# Altium schematic sheet mpll32.SchDoc
size A4
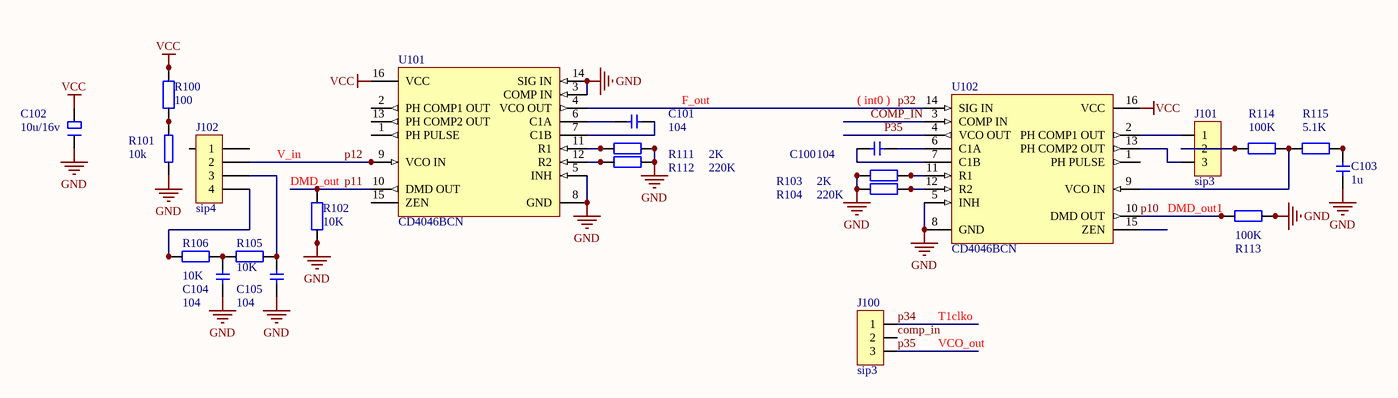
[diagram p0: mpll32.SchDoc]

## Parts
C100  104  [cap010805]
C101  104  [cap010805]
C102  10u/16v  [rb.1/.2]
C103  value 1u  [cap010805]  (hidden comment: 104)
C104  104  [cap010805]
C105  104  [cap010805]
J100  value sip3  [SIP3]  (hidden comment: CON3)
J101  value sip3  [SIP3]  (hidden comment: CON3)
J102  value sip4  [SIP4]  (hidden comment: CON4)
R100  value 100  [a030805]  (hidden comment: Res22)
R101  10k  [VR-5]
R102  value 10K  [a030805]  (hidden comment: Res22)
R103  value 2K  [a030805]  (hidden comment: Res22)
R104  value 220K  [a030805]  (hidden comment: Res22)
R105  value 10K  [a030805]  (hidden comment: RES22)
R106  value 10K  [a030805]  (hidden comment: RES22)
R111  value 2K  [a030805]  (hidden comment: Res22)
R112  value 220K  [a030805]  (hidden comment: Res22)
R113  value 100K  [a030805]  (hidden comment: Res22)
R114  value 100K  [a030805]  (hidden comment: Res22)
R115  value 5.1K  [a030805]  (hidden comment: Res22)
U101  CD4046BCN  [dip16]
U102  CD4046BCN  [dip16]

## Nets
GND: C102.1 C103.1 C104.2 C105.2 R101.1 R102.1 R102.3 R103.1 R103.3 R104.1 R104.3 R111.1 R111.3 R112.1 R112.3 R113.2 R113.4 U101.3(COMP_IN) U101.5(INH) U101.8(GND) U101.14(SIG_IN) U102.5(INH) U102.8(GND)
VCC: C102.2 R100.2 R100.4 U101.16(VCC) U102.16(VCC)
comp_in: J100.2 U102.3(COMP_IN)
p10: R113.1 R113.3 U102.10(DMD_OUT)
p11: R102.2 R102.4 U101.10(DMD_OUT)
p12: J102.2 U101.9(VCO_IN)
p32: U101.4(VCO_OUT) U102.14(SIG_IN)
p34: J100.1
p35: J100.3 U102.4(VCO_OUT)
NetC100_1: C100.1 U102.7(C1B)
NetC100_2: C100.2 U102.6(C1A)
NetC101_1: C101.1 U101.7(C1B)
NetC101_2: C101.2 U101.6(C1A)
NetC103_2: C103.2 R115.1 R115.3
NetC104_1: C104.1 R105.1 R105.3 R106.2 R106.4
NetC105_1: C105.1 J102.3 R105.2 R105.4
NetJ101_1: J101.1 U102.2(PH_COMP1_OUT)
NetJ101_2: J101.2 R114.1 R114.3
NetJ101_3: J101.3 U102.13(PH_COMP2_OUT)
NetJ102_1: J102.1 R101.2
NetJ102_4: J102.4 R106.1 R106.3
NetR100_1: R100.1 R100.3 R101.3
NetR103_2: R103.2 R103.4 U102.11(R1)
NetR104_2: R104.2 R104.4 U102.12(R2)
NetR111_2: R111.2 R111.4 U101.11(R1)
NetR112_2: R112.2 R112.4 U101.12(R2)
NetR114_2: R114.2 R114.4 R115.2 R115.4 U102.9(VCO_IN)

Not connected (* = marked no-connect by the designer): U101 1(PH_PULSE) 2(PH_COMP1_OUT) 13(PH_COMP2_OUT) 15(ZEN); U102 1(PH_PULSE) 15(ZEN)

## Notes on the sheet
- F_out
- ( int0 )
- V_in
- (near R102) DMD_out
- (near R113) DMD_out1
- T1clko
- VCO_out

## Library data of the parts
C100 C101 C103-C105 = CAP: Capacitor
  C100 C101 C103: Value: 104
  C104 C105: value: 104
C102 = ELECTRO1: Electrolytic Capacitor; Value: 10u/16v
J100 J101 = CON3: Connector
J102 = CON4: Connector
R100 R102-R104 R111-R115 = Res22: Resistor; Published: 8-Jun-2000; LatestRevisionDate: 17-Jul-2002; LatestRevisionNote: Re-released for DXP Platform.; PackageReference: AXIAL-0.4; Publisher: Altium Limited
R101 = RES3: 3296; value: 10k
R105 R106 = RES22: Resistor; Published: 8-Jun-2000; LatestRevisionDate: 17-Jul-2002; LatestRevisionNote: Re-released for DXP Platform.; PackageReference: AXIAL-0.4; Publisher: Altium Limited
U101 U102 = CD4046BCN: Micropower Phase-Locked Loop; Published: 17-Jul-2002; LatestRevisionDate: 04-Mar-2005; LatestRevisionNote: Stylized 3D Model Added.; DatasheetVersion: Jan-1999; PackageVersion: 2000; PackageReference: N16E; Publisher: Altium Limited; PackageDescription: DIP; 16 Leads; Row Spacing 7.62 mm; Pitch 2.54 mm; ComponentLink1Description: Manufacturer Link; ComponentLink1URL: http://www.fairchildsemi.com/; ComponentLink2Description: Datasheet; ComponentLink2URL: http://www.fairchildsemi.com/ds/CD%2FCD4046BC.pdf